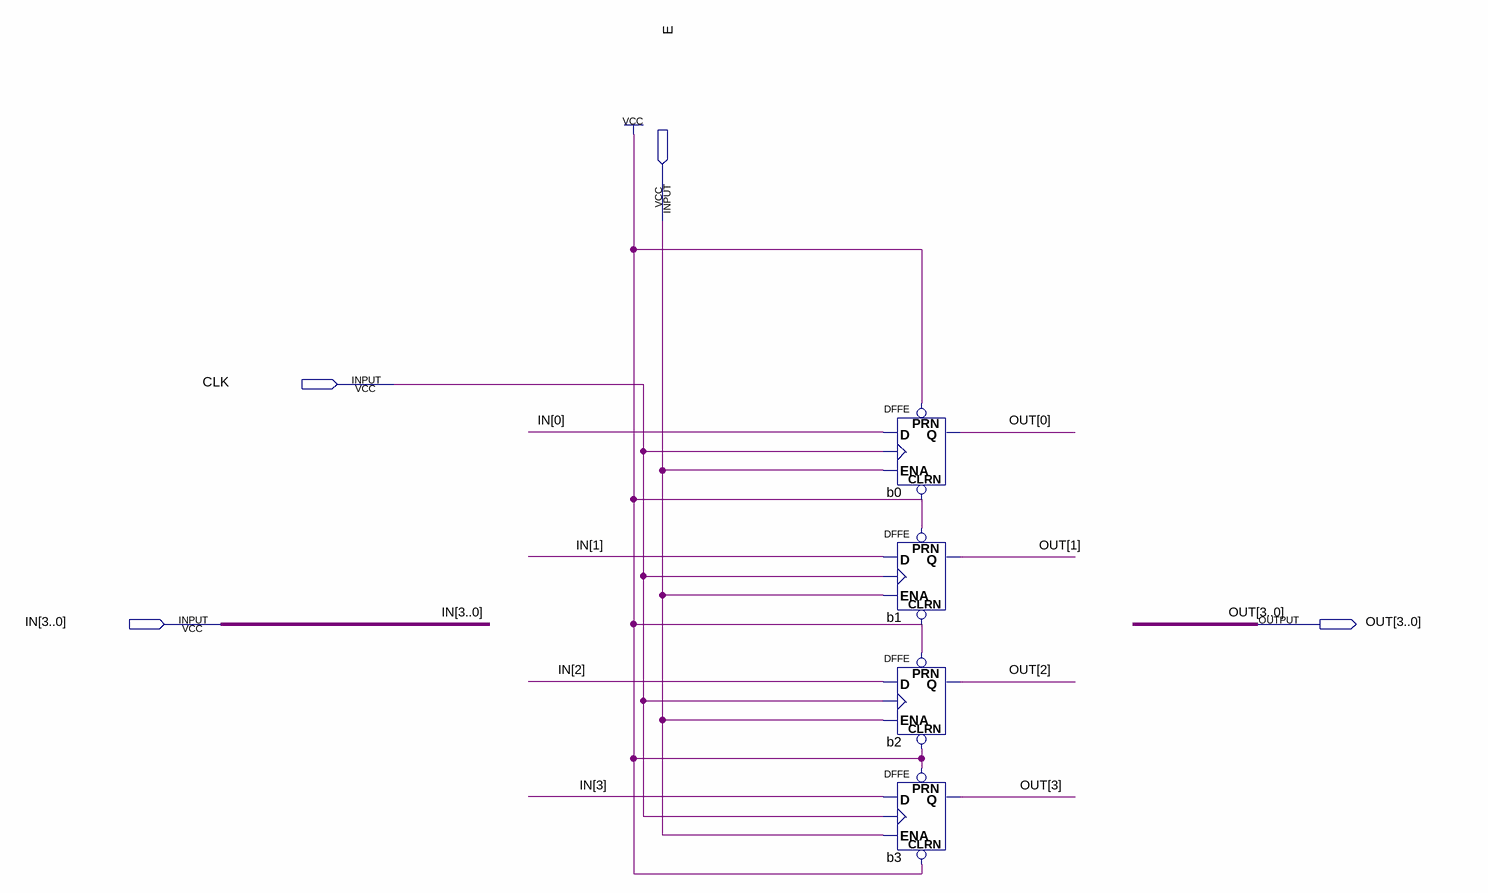
[diagram p0: schematic sheet]
// Quartus schematic reg4.bdf as structural Verilog: 4 symbols, 4 pins
module reg4 (
  input  E,
  input  CLK,
  input  [3:0] IN,
  output [3:0] OUT
);

  DFFE b0 (.PRN(1'b1), .CLRN(1'b1), .D(IN[0]), .CLK(CLK), .ENA(E), .Q(OUT[0]));
  DFFE b1 (.PRN(1'b1), .CLRN(1'b1), .D(IN[1]), .CLK(CLK), .ENA(E), .Q(OUT[1]));
  DFFE b2 (.PRN(1'b1), .CLRN(1'b1), .D(IN[2]), .CLK(CLK), .ENA(E), .Q(OUT[2]));
  DFFE b3 (.PRN(1'b1), .CLRN(1'b1), .D(IN[3]), .CLK(CLK), .ENA(E), .Q(OUT[3]));
endmodule
